# Altium project SMH118_ClassDesign.PrjPcb
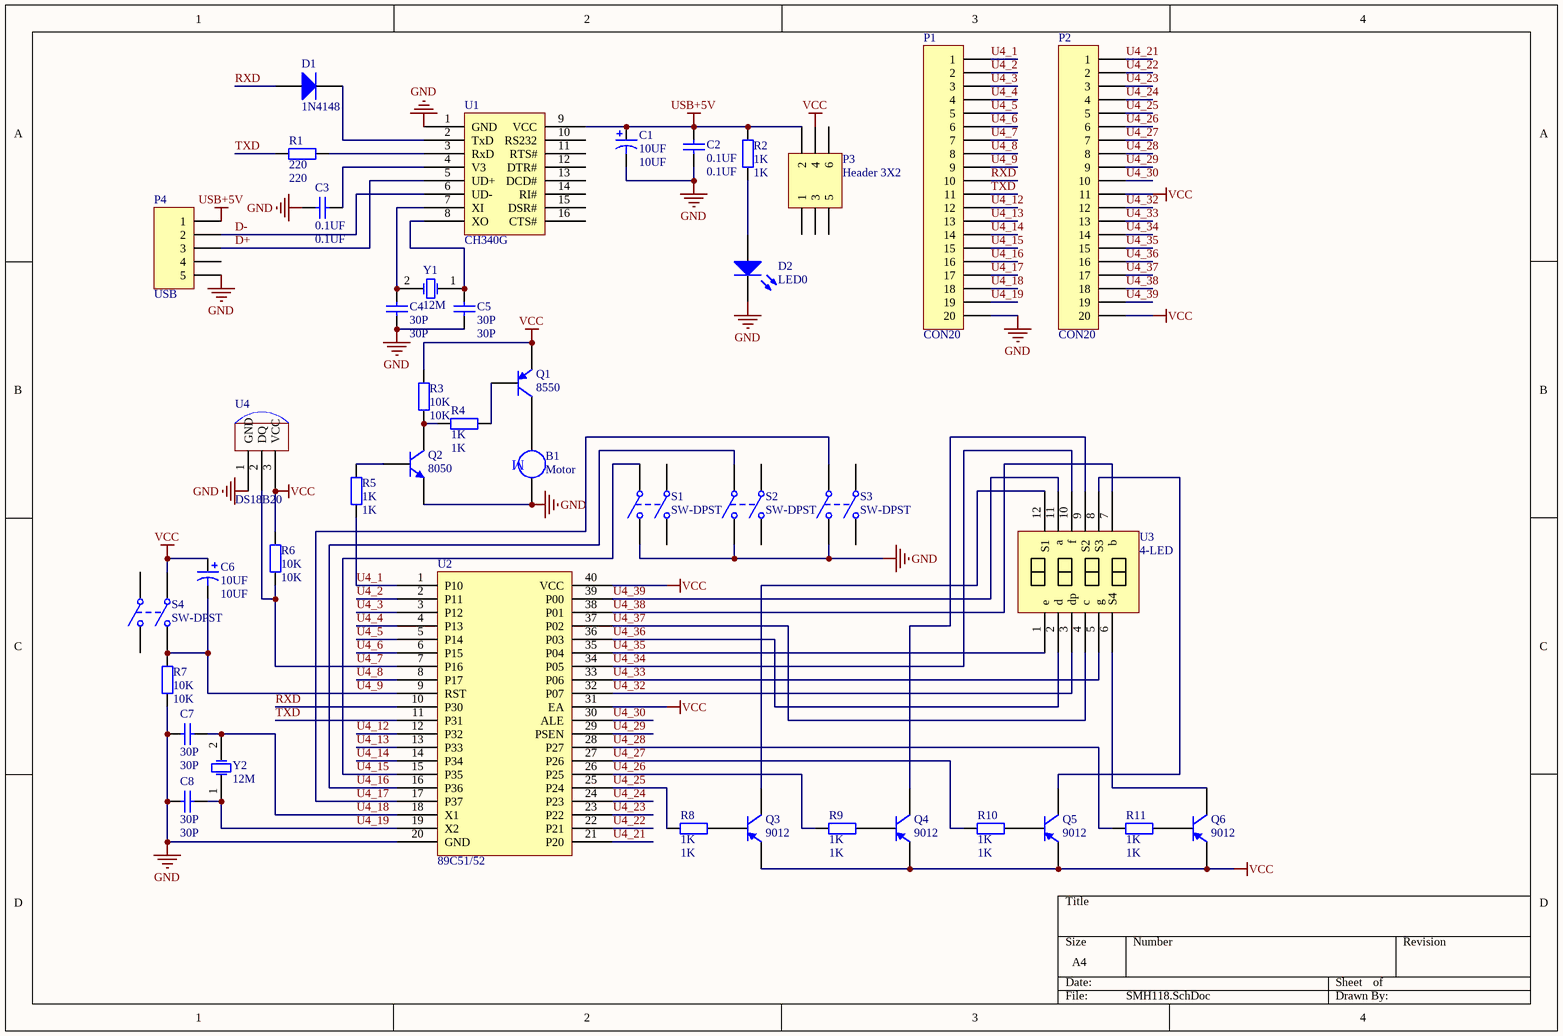
[diagram p0: SMH118.SchDoc]
1 sheet, 42 parts. Net scope: global (net labels, ports and power ports of the same name join across sheets).

## Sheet SMH118.SchDoc
size A4

### Parts
B1  Motor  [XH2.54-2P]
C1  10UF  [CD4]
C2  0.1UF  [CB1]
C3  0.1UF  [CB1]
C4  30P  [CB1]
C5  30P  [CB1]
C6  10UF  [CD4]
C7  30P  [CB1]
C8  30P  [CB1]
D1  1N4148  [DIODE0.3]
D2  LED0  [LED3]
P1  CON20  [SIP20]
P2  CON20  [SIP20]
P3  Header 3X2  [SW6 - 2]
P4  USB  [MINIUSB]
Q1  8550  [8050]
Q2  8050  [8050]
Q3  9012  [8050]
Q4  9012  [8050]
Q5  9012  [8050]
Q6  9012  [8050]
R1  220  [AXIAL-0.3]
R2  1K  [AXIAL-0.3]
R3  10K  [AXIAL-0.3]
R4  1K  [AXIAL-0.3]
R5  1K  [AXIAL-0.3]
R6  10K  [AXIAL-0.3]
R7  10K  [AXIAL-0.3]
R8  1K  [AXIAL-0.3]
R9  1K  [AXIAL-0.3]
R10  1K  [AXIAL-0.3]
R11  1K  [AXIAL-0.3]
S1  SW-DPST  [ANJIAN]
S2  SW-DPST  [ANJIAN]
S3  SW-DPST  [ANJIAN]
S4  SW-DPST  [ANJIAN]
U1  CH340G  [SO-16]
U2  89C51/52  [DIP40]
U3  4-LED  [.3684]
U4  DS18B20  [SIP3]
Y1  12M  [JZ]
Y2  12M  [JZ]

### Nets
GND: B1.1 C1.2 C2.1 C3.1 C4.1 C5.1 C7.1 C8.1 D2.K P1.20 P4.5 Q2.3(E) R7.1 S1.2(NO1) S2.2(NO1) S3.2(NO1) U1.1(GND) U2.20(GND) U4.1(GND)
USB+5V: C1.1 C2.2 P3.2 P4.1 R2.2 U1.9(VCC)
VCC: C6.1 P2.11 P2.20 P3.4 Q1.3(E) Q3.3(E) Q4.3(E) Q5.3(E) Q6.3(E) R3.2 R6.2 S4.3(COMMON2) U2.31(EA) U2.40(VCC) U4.3(VCC)
D+: P4.3 U1.5(UD+)
D-: P4.2 U1.6(UD-)
RXD: D1.1(A) P1.10 U2.10(P30)
TXD: P1.11 R1.1 U2.11(P31)
U4_1: P1.1 R5.2 U2.1(P10)
U4_2: P1.2 U2.2(P11)
U4_3: P1.3 U2.3(P12)
U4_4: P1.4 U2.4(P13)
U4_5: P1.5 U2.5(P14)
U4_6: P1.6 U2.6(P15)
U4_7: P1.7 R6.1 U2.7(P16) U4.2(DQ)
U4_8: P1.8 U2.8(P17)
U4_9: C6.2 P1.9 R7.2 S4.4(NO2) U2.9(RST)
U4_12: P1.12 U2.12(P32)
U4_13: P1.13 U2.13(P33)
U4_14: P1.14 U2.14(P34)
U4_15: P1.15 S1.1(COMMON1) U2.15(P35)
U4_16: P1.16 S2.1(COMMON1) U2.16(P36)
U4_17: P1.17 S3.1(COMMON1) U2.17(P37)
U4_18: C7.2 P1.18 U2.18(X1) Y2.2(OSC2)
U4_19: C8.2 P1.19 U2.19(X2) Y2.1(OSC1)
U4_21: P2.1 U2.21(P20)
U4_22: P2.2 U2.22(P21)
U4_23: P2.3 U2.23(P22)
U4_24: P2.4 U2.24(P23)
U4_25: P2.5 R8.2 U2.25(P24)
U4_26: P2.6 R9.2 U2.26(P25)
U4_27: P2.7 R10.2 U2.27(P26)
U4_28: P2.8 R11.2 U2.28(P27)
U4_29: P2.9 U2.29(PSEN)
U4_30: P2.10 U2.30(ALE)
U4_32: P2.12 U2.32(P07) U3.3(dp)
U4_33: P2.13 U2.33(P06) U3.5(g)
U4_34: P2.14 U2.34(P05) U3.10(f)
U4_35: P2.15 U2.35(P04) U3.1(e)
U4_36: P2.16 U2.36(P03) U3.2(d)
U4_37: P2.17 U2.37(P02) U3.4(c)
U4_38: P2.18 U2.38(P01) U3.7(b)
U4_39: P2.19 U2.39(P00) U3.11(a)
NetB1_2: B1.2 Q1.1(C)
NetC3_2: C3.2 U1.4(V3)
NetC4_2: C4.2 U1.7(XI) Y1.2(OSC2)
NetC5_2: C5.2 U1.8(XO) Y1.1(OSC1)
NetD1_2: D1.2(K) U1.2(TxD)
NetD2_A: D2.A R2.1
NetQ1_2: Q1.2(B) R4.1
NetQ2_1: Q2.1(C) R3.1 R4.2
NetQ2_2: Q2.2(B) R5.1
NetQ3_1: Q3.1(C) U3.12(S1)
NetQ3_2: Q3.2(B) R8.1
NetQ4_1: Q4.1(C) U3.9(S2)
NetQ4_2: Q4.2(B) R9.1
NetQ5_1: Q5.1(C) U3.8(S3)
NetQ5_2: Q5.2(B) R10.1
NetQ6_1: Q6.1(C) U3.6(S4)
NetQ6_2: Q6.2(B) R11.1
NetR1_2: R1.2 U1.3(RxD)

Not connected (* = marked no-connect by the designer): P3 1 3 5 6; P4 4; S1 3(COMMON2) 4(NO2); S2 3(COMMON2) 4(NO2); S3 3(COMMON2) 4(NO2); S4 1(COMMON1) 2(NO1); U1 10(RS232) 11(RTS#) 12(DTR#) 13(DCD#) 14(RI#) 15(DSR#) 16(CTS#)

### Notes on the sheet
- (in symbol Motor) M

### Library data of the parts
B1 = Motor: Motor, General Kind; Published: 24-Mar-1999; LatestRevisionDate: 17-Jul-2002; LatestRevisionNote: Re-released for DXP Platform.; PackageReference: RB5-10.5; Publisher: Altium Limited; PackageDescription: Capacitor (Radial); 2 Leads
C1 C6 = Cap Pol1: Polarized Capacitor (Radial); Published: 8-Jun-2000; LatestRevisionDate: 17-Jul-2002; LatestRevisionNote: Re-released for DXP Platform.; PackageReference: RB7.6-15; Publisher: Altium Limited; PackageDescription: Polarized Capacitor (Radial); 2 Leads; Value: 10UF
C2-C5 C7 C8 = Cap: Capacitor; Published: 8-Jun-2000; LatestRevisionDate: 17-Jul-2002; LatestRevisionNote: Re-released for DXP Platform.; PackageReference: RAD-0.3; Publisher: Altium Limited; PackageDescription: Radial Cap, Thru-Hole; 2 Leads; 0.3 in Pin Spacing
  C2 C3: Value: 0.1UF
  C4 C5 C7 C8: Value: 30P
D1 = Diode 1N4148: High Conductance Fast Diode; Published: 8-Jun-2000; LatestRevisionDate: 17-Jul-2002; LatestRevisionNote: Re-released for DXP Platform.; DatasheetVersion: 1997; PackageReference: DO-35; Publisher: Altium Limited; PackageDescription: Diode, Axial; Body 3.8 x 1.9 mm (LxDia. max), Lead Dia. 0.53 mm (max); Code_JEDEC: DO-204-AH; ComponentLink1Description: Manufacturer Link; ComponentLink1URL: http://www.fairchildsemi.com/; ComponentLink2Description: Datasheet; ComponentLink2URL: http://www.fairchildsemi.com/ds/1N%2F1N4148.pdf
D2 = LED0: Typical INFRARED GaAs LED; Published: 8-Jun-2000; LatestRevisionDate: 08-Jul-2005; LatestRevisionNote: Mech Layer 1 removed.; PackageReference: LED-0; Publisher: Altium Limited; PackageDescription: LED; 2 Leads
P1 P2 = Header 20: Header, 20-Pin; LatestRevisionDate: 17-Jul-2002; LatestRevisionNote: Re-released for DXP Platform.; Publisher: Altium Limited
P3 = Header 3X2: Header, 3-Pin, Dual row; LatestRevisionDate: 17-Jul-2002; LatestRevisionNote: Re-released for DXP Platform.; Publisher: Altium Limited
P4 = Header 5: Header, 5-Pin; LatestRevisionDate: 17-Jul-2002; LatestRevisionNote: Re-released for DXP Platform.; Publisher: Altium Limited
Q1 Q3-Q6 = PNP: PNP Bipolar Transistor; Published: 8-Jun-2000; LatestRevisionDate: 29-May-2009; LatestRevisionNote: IPC-7351 Footprint Added.; PackageVersion: Aug-1999; PackageReference: SOT-23B; Publisher: Altium Limited; PackageDescription: 3-Pin SOT-23 Package 0.95 mm Pitch, 2.4 mm Lead Span
Q2 = NPN: NPN Bipolar Transistor; Published: 8-Jun-2000; LatestRevisionDate: 17-Jul-2002; LatestRevisionNote: Re-released for DXP Platform.; PackageReference: TO-226-AA; Publisher: Altium Limited; PackageDescription: TO, Flat Index; 3 In-Line, Axial Leads; Body Dia. 4.8mm; Leads 0.55 x 0.51 mm (max); Code_JEDEC: TO-226-AA
R1-R11 = Res2: Resistor; Published: 8-Jun-2000; LatestRevisionDate: 17-Jul-2002; LatestRevisionNote: Re-released for DXP Platform.; PackageReference: AXIAL-0.4; Publisher: Altium Limited; PackageDescription: Axial Device, Thru-Hole; 2 Leads; 0.4 in Pin Spacing
  R1: Value: 220
  R2 R4 R5 R8-R11: Value: 1K
  R3 R6 R7: Value: 10K
S1-S4 = SW-DPST: Double-Pole, Single-Throw Switch; Published: 24-Mar-1999; LatestRevisionDate: 17-Jul-2002; LatestRevisionNote: Re-released for DXP Platform.; PackageReference: DPST-4; Publisher: Altium Limited; PackageDescription: Switch; 4 Leads
Y1 Y2 = XTAL: Crystal Oscillator; Published: 8-Jun-2000; LatestRevisionDate: 17-Jul-2002; LatestRevisionNote: Re-released for DXP Platform.; PackageReference: R38; Publisher: Altium Limited; PackageDescription: Crystal, Thru-Hole; 2 Leads; Body 3.1 x 8.2 mm (Dia.xH)